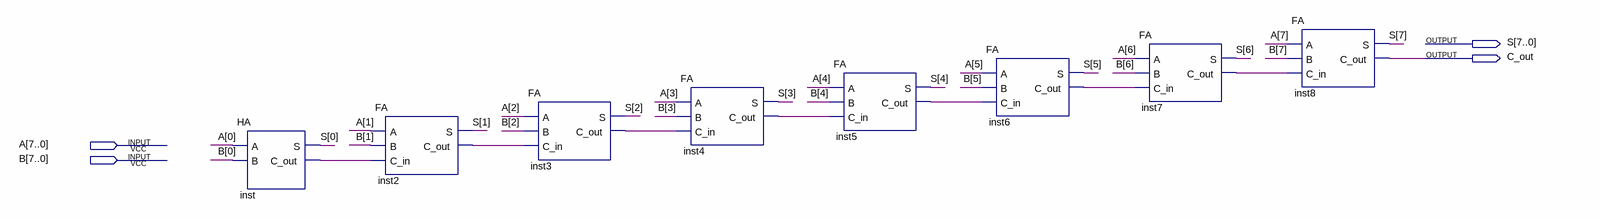
[diagram p0: schematic sheet]
// Quartus schematic RCA.bdf as structural Verilog: 8 symbols, 4 pins
module RCA (
  input  [7:0] A,
  input  [7:0] B,
  output [7:0] S,
  output C_out
);

  wire inst2_c_out, inst3_c_out, inst4_c_out, inst5_c_out, inst6_c_out, inst7_c_out, inst_c_out;

  HA inst (.A(A[0]), .B(B[0]), .S(S[0]), .C_out(inst_c_out));
  FA inst2 (.A(A[1]), .B(B[1]), .C_in(inst_c_out), .S(S[1]), .C_out(inst2_c_out));
  FA inst3 (.A(A[2]), .B(B[2]), .C_in(inst2_c_out), .S(S[2]), .C_out(inst3_c_out));
  FA inst4 (.A(A[3]), .B(B[3]), .C_in(inst3_c_out), .S(S[3]), .C_out(inst4_c_out));
  FA inst5 (.A(A[4]), .B(B[4]), .C_in(inst4_c_out), .S(S[4]), .C_out(inst5_c_out));
  FA inst6 (.A(A[5]), .B(B[5]), .C_in(inst5_c_out), .S(S[5]), .C_out(inst6_c_out));
  FA inst7 (.A(A[6]), .B(B[6]), .C_in(inst6_c_out), .S(S[6]), .C_out(inst7_c_out));
  FA inst8 (.A(A[7]), .B(B[7]), .C_in(inst7_c_out), .S(S[7]), .C_out(C_out));
endmodule
